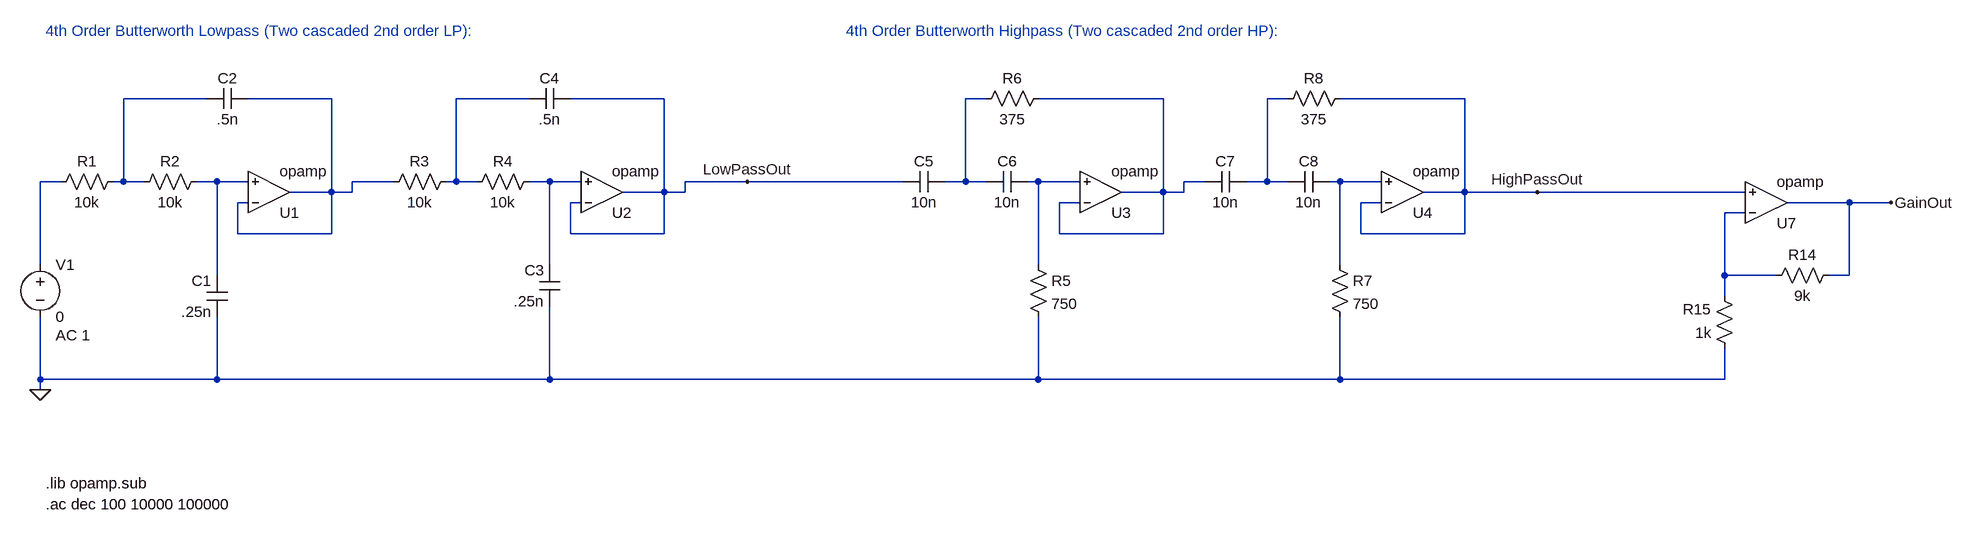
[diagram p0: schematic BMERobotics4thOrderNotch.asc]
BMERobotics4thOrderNotch.asc, the LTspice schematic file:
Version 4
SHEET 1 4608 1124
WIRE 0 0 -128 0
WIRE 192 0 64 0
WIRE 496 0 384 0
WIRE 704 0 560 0
WIRE 1200 0 1168 0
WIRE 1472 0 1280 0
WIRE 1664 0 1632 0
WIRE 1936 0 1744 0
WIRE -224 128 -256 128
WIRE -128 128 -128 0
WIRE -128 128 -144 128
WIRE -96 128 -128 128
WIRE 16 128 -16 128
WIRE 64 128 16 128
WIRE 288 128 224 128
WIRE 384 128 384 0
WIRE 384 128 368 128
WIRE 416 128 384 128
WIRE 528 128 496 128
WIRE 576 128 528 128
WIRE 832 128 736 128
WIRE 1072 128 832 128
WIRE 1168 128 1168 0
WIRE 1168 128 1136 128
WIRE 1200 128 1168 128
WIRE 1280 128 1264 128
WIRE 1344 128 1280 128
WIRE 1536 128 1504 128
WIRE 1632 128 1632 0
WIRE 1632 128 1600 128
WIRE 1664 128 1632 128
WIRE 1744 128 1728 128
WIRE 1808 128 1744 128
WIRE 192 144 192 0
WIRE 192 144 128 144
WIRE 224 144 224 128
WIRE 224 144 192 144
WIRE 704 144 704 0
WIRE 704 144 640 144
WIRE 736 144 736 128
WIRE 736 144 704 144
WIRE 1472 144 1472 0
WIRE 1472 144 1408 144
WIRE 1504 144 1504 128
WIRE 1504 144 1472 144
WIRE 1936 144 1936 0
WIRE 1936 144 1872 144
WIRE 2048 144 1936 144
WIRE 2368 144 2048 144
WIRE 64 160 48 160
WIRE 576 160 560 160
WIRE 1344 160 1312 160
WIRE 1808 160 1776 160
WIRE 2528 160 2432 160
WIRE 2592 160 2528 160
WIRE 2368 176 2336 176
WIRE 48 208 48 160
WIRE 192 208 192 144
WIRE 192 208 48 208
WIRE 560 208 560 160
WIRE 704 208 704 144
WIRE 704 208 560 208
WIRE 1312 208 1312 160
WIRE 1472 208 1472 144
WIRE 1472 208 1312 208
WIRE 1776 208 1776 160
WIRE 1936 208 1936 144
WIRE 1936 208 1776 208
WIRE -256 256 -256 128
WIRE 528 256 528 128
WIRE 1280 256 1280 128
WIRE 1744 256 1744 128
WIRE 16 272 16 128
WIRE 2336 272 2336 176
WIRE 2416 272 2336 272
WIRE 2528 272 2528 160
WIRE 2528 272 2496 272
WIRE 2336 304 2336 272
WIRE -256 432 -256 336
WIRE 16 432 16 336
WIRE 16 432 -256 432
WIRE 528 432 528 320
WIRE 528 432 16 432
WIRE 1280 432 1280 336
WIRE 1280 432 528 432
WIRE 1744 432 1744 336
WIRE 1744 432 1280 432
WIRE 2336 432 2336 384
WIRE 2336 432 1744 432
WIRE -256 448 -256 432
FLAG -256 448 0
FLAG 832 128 LowPassOut
FLAG 2048 144 HighPassOut
FLAG 2592 160 GainOut
SYMBOL cap 32 336 R180
WINDOW 0 24 56 Left 2
WINDOW 3 24 8 Left 2
SYMATTR InstName C1
SYMATTR Value .25n
SYMBOL cap 64 -16 R90
WINDOW 0 0 32 VBottom 2
WINDOW 3 32 32 VTop 2
SYMATTR InstName C2
SYMATTR Value .5n
SYMBOL voltage -256 240 R0
WINDOW 123 24 124 Left 2
WINDOW 39 0 0 Left 0
SYMATTR Value2 AC 1
SYMATTR InstName V1
SYMATTR Value 0
SYMBOL OpAmps\\opamp 96 208 M180
SYMATTR InstName U1
SYMBOL res -128 112 R90
WINDOW 0 0 56 VBottom 2
WINDOW 3 32 56 VTop 2
SYMATTR InstName R1
SYMATTR Value 10k
SYMBOL res 0 112 R90
WINDOW 0 0 56 VBottom 2
WINDOW 3 32 56 VTop 2
SYMATTR InstName R2
SYMATTR Value 10k
SYMBOL cap 544 320 R180
WINDOW 0 24 56 Left 2
WINDOW 3 24 8 Left 2
SYMATTR InstName C3
SYMATTR Value .25n
SYMBOL cap 560 -16 R90
WINDOW 0 0 32 VBottom 2
WINDOW 3 32 32 VTop 2
SYMATTR InstName C4
SYMATTR Value .5n
SYMBOL OpAmps\\opamp 608 208 M180
SYMATTR InstName U2
SYMBOL res 384 112 R90
WINDOW 0 0 56 VBottom 2
WINDOW 3 32 56 VTop 2
SYMATTR InstName R3
SYMATTR Value 10k
SYMBOL res 512 112 R90
WINDOW 0 0 56 VBottom 2
WINDOW 3 32 56 VTop 2
SYMATTR InstName R4
SYMATTR Value 10k
SYMBOL cap 1136 112 R90
WINDOW 0 0 32 VBottom 2
WINDOW 3 32 32 VTop 2
SYMATTR InstName C5
SYMATTR Value 10n
SYMBOL cap 1264 112 R90
WINDOW 0 0 32 VBottom 2
WINDOW 3 32 32 VTop 2
SYMATTR InstName C6
SYMATTR Value 10n
SYMBOL OpAmps\\opamp 1376 208 M180
SYMATTR InstName U3
SYMBOL res 1264 240 R0
SYMATTR InstName R5
SYMATTR Value 750
SYMBOL res 1296 -16 R90
WINDOW 0 0 56 VBottom 2
WINDOW 3 32 56 VTop 2
SYMATTR InstName R6
SYMATTR Value 375
SYMBOL cap 1600 112 R90
WINDOW 0 0 32 VBottom 2
WINDOW 3 32 32 VTop 2
SYMATTR InstName C7
SYMATTR Value 10n
SYMBOL cap 1728 112 R90
WINDOW 0 0 32 VBottom 2
WINDOW 3 32 32 VTop 2
SYMATTR InstName C8
SYMATTR Value 10n
SYMBOL OpAmps\\opamp 1840 208 M180
SYMATTR InstName U4
SYMBOL res 1728 240 R0
SYMATTR InstName R7
SYMATTR Value 750
SYMBOL res 1760 -16 R90
WINDOW 0 0 56 VBottom 2
WINDOW 3 32 56 VTop 2
SYMATTR InstName R8
SYMATTR Value 375
SYMBOL OpAmps\\opamp 2400 224 M180
SYMATTR InstName U7
SYMBOL res 2512 256 R90
WINDOW 0 0 56 VBottom 2
WINDOW 3 32 56 VTop 2
SYMATTR InstName R14
SYMATTR Value 9k
SYMBOL res 2352 400 R180
WINDOW 0 36 76 Left 2
WINDOW 3 36 40 Left 2
SYMATTR InstName R15
SYMATTR Value 1k
TEXT -248 592 Left 2 !.lib opamp.sub
TEXT -248 -104 Left 2 ;4th Order Butterworth Lowpass (Two cascaded 2nd order LP):
TEXT 984 -104 Left 2 ;4th Order Butterworth Highpass (Two cascaded 2nd order HP):
TEXT -248 624 Left 2 !.ac dec 100 10000 100000

The netlist it stands for:
* BMERobotics4thOrderNotch.asc
C1 0 N008 .25n
C2 N002 N001 .5n
V1 N007 0 0 AC 1
XU1 N002 N008 N002 opamp Aol=100K GBW=10Meg  ; pins invin noninvin out
R1 N001 N007 10k
R2 N008 N001 10k
C3 0 N009 .25n
C4 LowPassOut N003 .5n
XU2 LowPassOut N009 LowPassOut opamp Aol=100K GBW=10Meg  ; pins invin noninvin out
R3 N003 N002 10k
R4 N009 N003 10k
C5 N004 LowPassOut 10n
C6 N010 N004 10n
XU3 N005 N010 N005 opamp Aol=100K GBW=10Meg  ; pins invin noninvin out
R5 N010 0 750
R6 N005 N004 375
C7 N006 N005 10n
C8 N011 N006 10n
XU4 HighPassOut N011 HighPassOut opamp Aol=100K GBW=10Meg  ; pins invin noninvin out
R7 N011 0 750
R8 HighPassOut N006 375
XU7 N012 HighPassOut GainOut opamp Aol=100K GBW=10Meg  ; pins invin noninvin out
R14 GainOut N012 9k
R15 0 N012 1k
.lib opamp.sub
* 4th Order Butterworth Lowpass (Two cascaded 2nd order LP):
* 4th Order Butterworth Highpass (Two cascaded 2nd order HP):
.ac dec 100 10000 100000
.backanno
.end

* Results of the author's LTspice run, read from the files saved beside the schematic
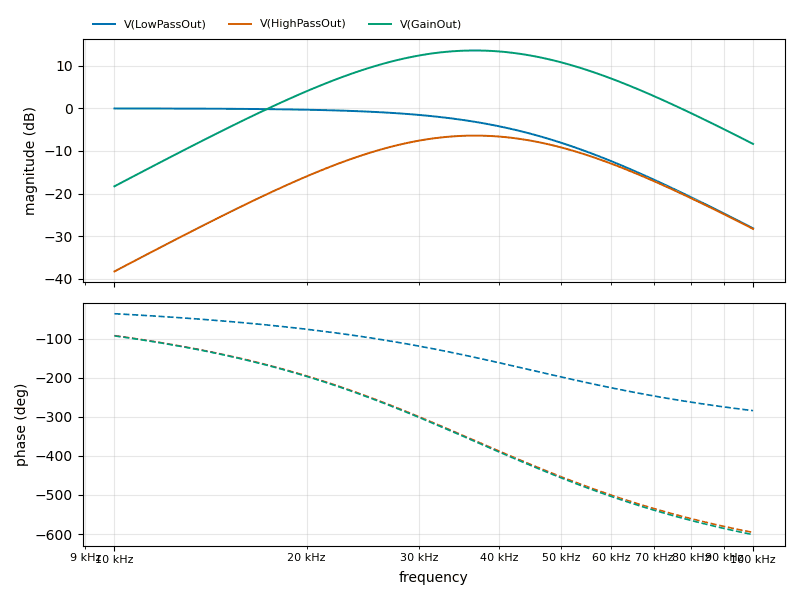
[diagram p1: AC Analysis of BMERobotics4thOrderNotch.asc, plotted from the saved traces]
* AC Analysis, 1 run:
*   V(LowPassOut): -0.02 dB at 10 kHz, -28.17 dB at 100 kHz, peak -0.02 dB at 10 kHz, 3 dB below the peak at 36.23 kHz
*   V(HighPassOut): -38.30 dB at 10 kHz, -28.30 dB at 100 kHz, peak -6.39 dB at 36.31 kHz, 3 dB below the peak at 26.51 kHz and 50.71 kHz
*   V(GainOut): -18.30 dB at 10 kHz, -8.35 dB at 100 kHz, peak 13.60 dB at 36.31 kHz, 3 dB below the peak at 26.5 kHz and 50.7 kHz